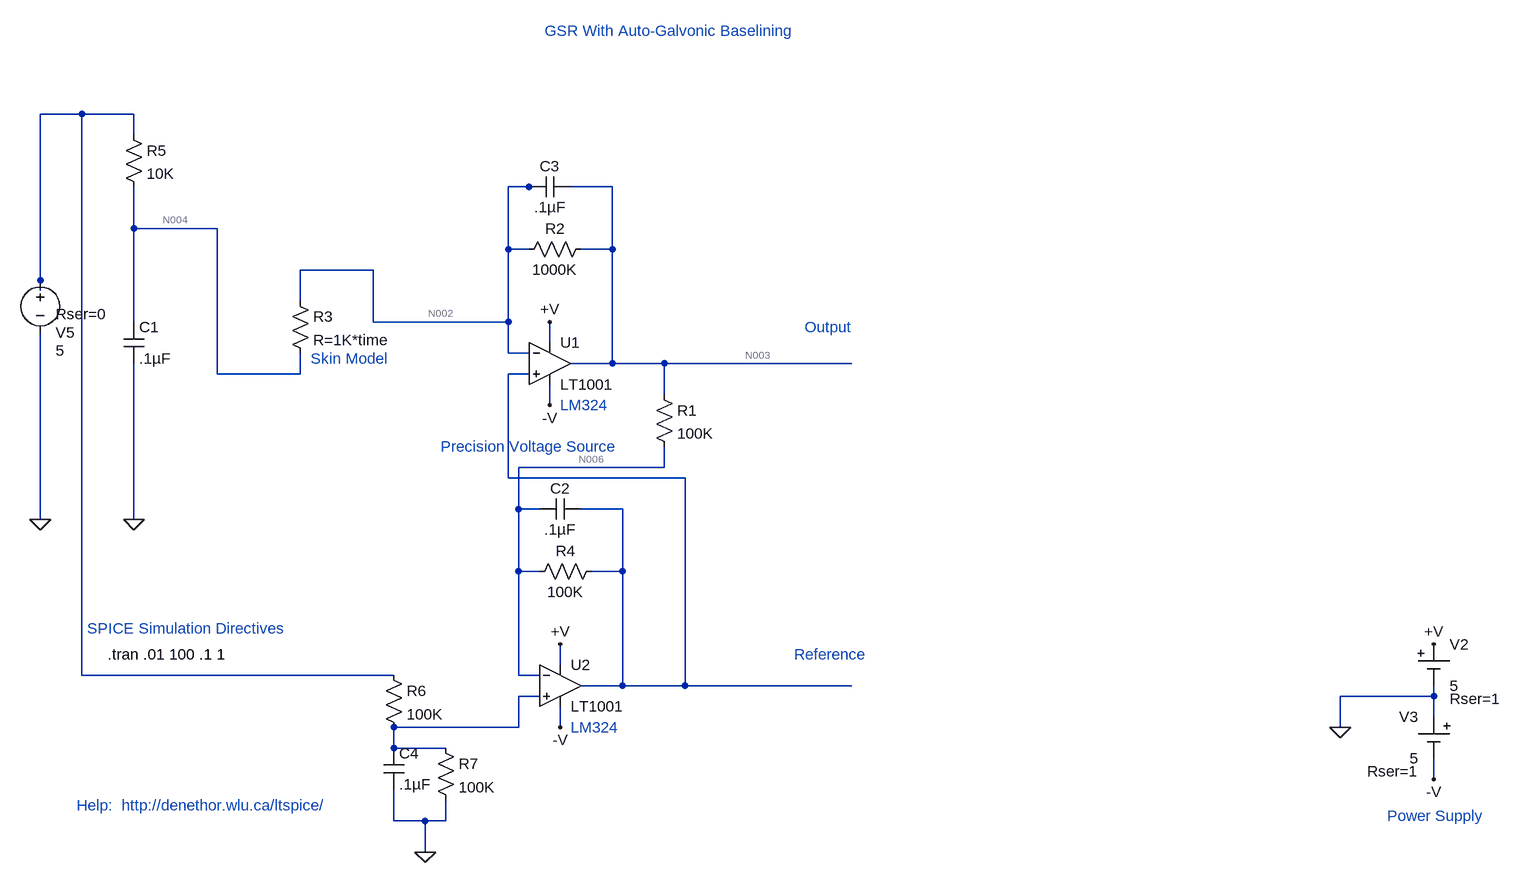
[diagram p0: schematic GSR6.asc]
GSR6.asc, the LTspice schematic file:
Version 4
SHEET 1 1356 1016
WIRE -1344 -208 -1408 -208
WIRE -1264 -208 -1344 -208
WIRE -1264 -176 -1264 -208
WIRE -656 -96 -688 -96
WIRE -640 -96 -656 -96
WIRE -528 -96 -592 -96
WIRE -1264 -32 -1264 -96
WIRE -1136 -32 -1264 -32
WIRE -688 0 -688 -96
WIRE -656 0 -688 0
WIRE -528 0 -528 -96
WIRE -528 0 -576 0
WIRE -896 32 -1008 32
WIRE -1408 48 -1408 -208
WIRE -1408 64 -1408 48
WIRE -1008 80 -1008 32
WIRE -1264 112 -1264 -32
WIRE -896 112 -896 32
WIRE -688 112 -688 0
WIRE -688 112 -896 112
WIRE -624 144 -624 112
WIRE -688 160 -688 112
WIRE -656 160 -688 160
WIRE -528 176 -528 0
WIRE -528 176 -592 176
WIRE -448 176 -528 176
WIRE -160 176 -448 176
WIRE -1136 192 -1136 -32
WIRE -1008 192 -1008 160
WIRE -1008 192 -1136 192
WIRE -656 192 -688 192
WIRE -448 224 -448 176
WIRE -624 240 -624 208
WIRE -448 336 -448 304
WIRE -448 336 -672 336
WIRE -688 352 -688 192
WIRE -416 352 -688 352
WIRE -672 400 -672 336
WIRE -640 400 -672 400
WIRE -512 400 -576 400
WIRE -1408 416 -1408 128
WIRE -1264 416 -1264 176
WIRE -672 496 -672 400
WIRE -640 496 -672 496
WIRE -512 496 -512 400
WIRE -512 496 -560 496
WIRE -608 640 -608 608
WIRE -1344 656 -1344 -208
WIRE -864 656 -1344 656
WIRE -672 656 -672 496
WIRE -640 656 -672 656
WIRE -512 672 -512 496
WIRE -512 672 -576 672
WIRE -416 672 -416 352
WIRE -416 672 -512 672
WIRE -160 672 -416 672
WIRE -640 688 -672 688
WIRE 736 688 736 672
WIRE 736 688 592 688
WIRE 736 720 736 688
WIRE -672 736 -672 688
WIRE -672 736 -864 736
WIRE -608 736 -608 704
WIRE 592 736 592 688
WIRE -864 768 -864 736
WIRE -784 768 -864 768
WIRE 736 816 736 784
WIRE -864 880 -864 832
WIRE -816 880 -864 880
WIRE -784 880 -784 848
WIRE -784 880 -816 880
WIRE -816 928 -816 880
FLAG 736 608 +V
FLAG 736 816 -V
FLAG 592 736 0
FLAG -1408 416 0
FLAG -1264 416 0
FLAG -624 240 -V
FLAG -624 112 +V
FLAG -608 736 -V
FLAG -608 608 +V
FLAG -816 928 0
SYMBOL Misc\\cell 736 608 R0
WINDOW 123 0 0 Left 2
WINDOW 39 24 84 Left 2
SYMATTR SpiceLine Rser=1
SYMATTR InstName V2
SYMATTR Value 5
SYMBOL Misc\\cell 736 720 M0
WINDOW 123 0 0 Left 2
WINDOW 39 24 84 Left 2
SYMATTR SpiceLine Rser=1
SYMATTR InstName V3
SYMATTR Value 5
SYMBOL voltage -1408 32 R0
WINDOW 0 24 96 Left 2
WINDOW 3 24 124 Left 2
WINDOW 39 24 68 Left 2
WINDOW 123 0 0 Left 2
SYMATTR InstName V5
SYMATTR Value 5
SYMATTR SpiceLine Rser=0
SYMBOL res -1024 64 R0
SYMATTR InstName R3
SYMATTR Value R=1K*time
SYMBOL cap -1280 112 R0
SYMATTR InstName C1
SYMATTR Value .1µF
SYMBOL Opamps\\LT1001 -624 112 R0
SYMATTR InstName U1
SYMBOL res -560 -16 R90
WINDOW 0 0 56 VBottom 2
WINDOW 3 32 56 VTop 2
SYMATTR InstName R2
SYMATTR Value 1000K
SYMBOL cap -592 -112 R90
WINDOW 0 0 32 VBottom 2
WINDOW 3 32 32 VTop 2
SYMATTR InstName C3
SYMATTR Value .1µF
SYMBOL res -464 208 R0
SYMATTR InstName R1
SYMATTR Value 100K
SYMBOL Opamps\\LT1001 -608 608 R0
SYMATTR InstName U2
SYMBOL res -544 480 R90
WINDOW 0 0 56 VBottom 2
WINDOW 3 32 56 VTop 2
SYMATTR InstName R4
SYMATTR Value 100K
SYMBOL cap -576 384 R90
WINDOW 0 0 32 VBottom 2
WINDOW 3 32 32 VTop 2
SYMATTR InstName C2
SYMATTR Value .1µF
SYMBOL cap -880 768 R0
SYMATTR InstName C4
SYMATTR Value .1µF
SYMBOL res -880 640 R0
SYMATTR InstName R6
SYMATTR Value 100K
SYMBOL res -800 752 R0
SYMATTR InstName R7
SYMATTR Value 100K
SYMBOL res -1280 -192 R0
SYMATTR InstName R5
SYMATTR Value 10K
TEXT -1352 856 Left 2 ;Help:  http://denethor.wlu.ca/ltspice/
TEXT -1336 584 Left 2 ;SPICE Simulation Directives
TEXT -1304 624 Left 2 !.tran .01 100 .1 1
TEXT 664 872 Left 2 ;Power Supply
TEXT -792 304 Left 2 ;Precision Voltage Source
TEXT -608 240 Left 2 ;LM324
TEXT -992 168 Left 2 ;Skin Model
TEXT -592 736 Left 2 ;LM324
TEXT -632 -336 Left 2 ;GSR With Auto-Galvonic Baselining
TEXT -248 624 Left 2 ;Reference
TEXT -232 120 Left 2 ;Output

The netlist it stands for:
* GSR6.asc
V2 +V 0 5 Rser=1
V3 0 -V 5 Rser=1
V5 N001 0 5 Rser=0
R3 N002 N004 R=1K*time
C1 N004 0 .1µF
XU1 N005 N002 +V -V N003 LT1001  ; pins In+ In- V+ V- OUT
R2 N003 N002 1000K
C3 N003 N002 .1µF
R1 N003 N006 100K
XU2 N007 N006 +V -V N005 LT1001  ; pins In+ In- V+ V- OUT
R4 N005 N006 100K
C2 N005 N006 .1µF
C4 N007 0 .1µF
R6 N001 N007 100K
R7 N007 0 100K
R5 N001 N004 10K
* Help:  http://denethor.wlu.ca/ltspice/
* SPICE Simulation Directives
.tran .01 100 .1 1
* Power Supply
* Precision Voltage Source
* LM324
* Skin Model
* LM324
* GSR With Auto-Galvonic Baselining
* Reference
* Output
.lib LTC.lib
.backanno
.end

* Results of the author's LTspice run, read from the files saved beside the schematic
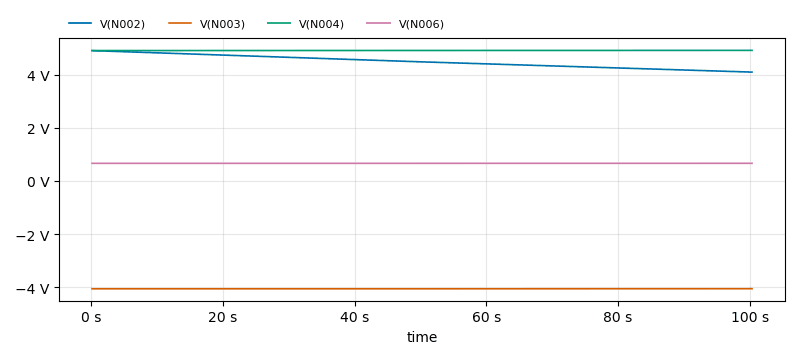
[diagram p1: Transient Analysis of GSR6.asc, plotted from the saved traces]
* Transient Analysis, 1 run:
*   V(N002): min 4.101 V, max 4.909 V, average 4.494 V, rms 4.504 V, last 4.101 V
*   V(N003): min -4.064 V, max -4.06 V, average -4.063 V, rms 4.063 V, last -4.06 V
*   V(N004): min 4.91 V, max 4.918 V, average 4.914 V, rms 4.914 V, last 4.918 V
*   V(N006): min 662.9 mV, max 664 mV, average 663.2 mV, rms 663.2 mV, last 664 mV